# Altium schematic sheet PowerSupply.SchDoc
size A4; SheetNumber: 1; SheetTotal: 2
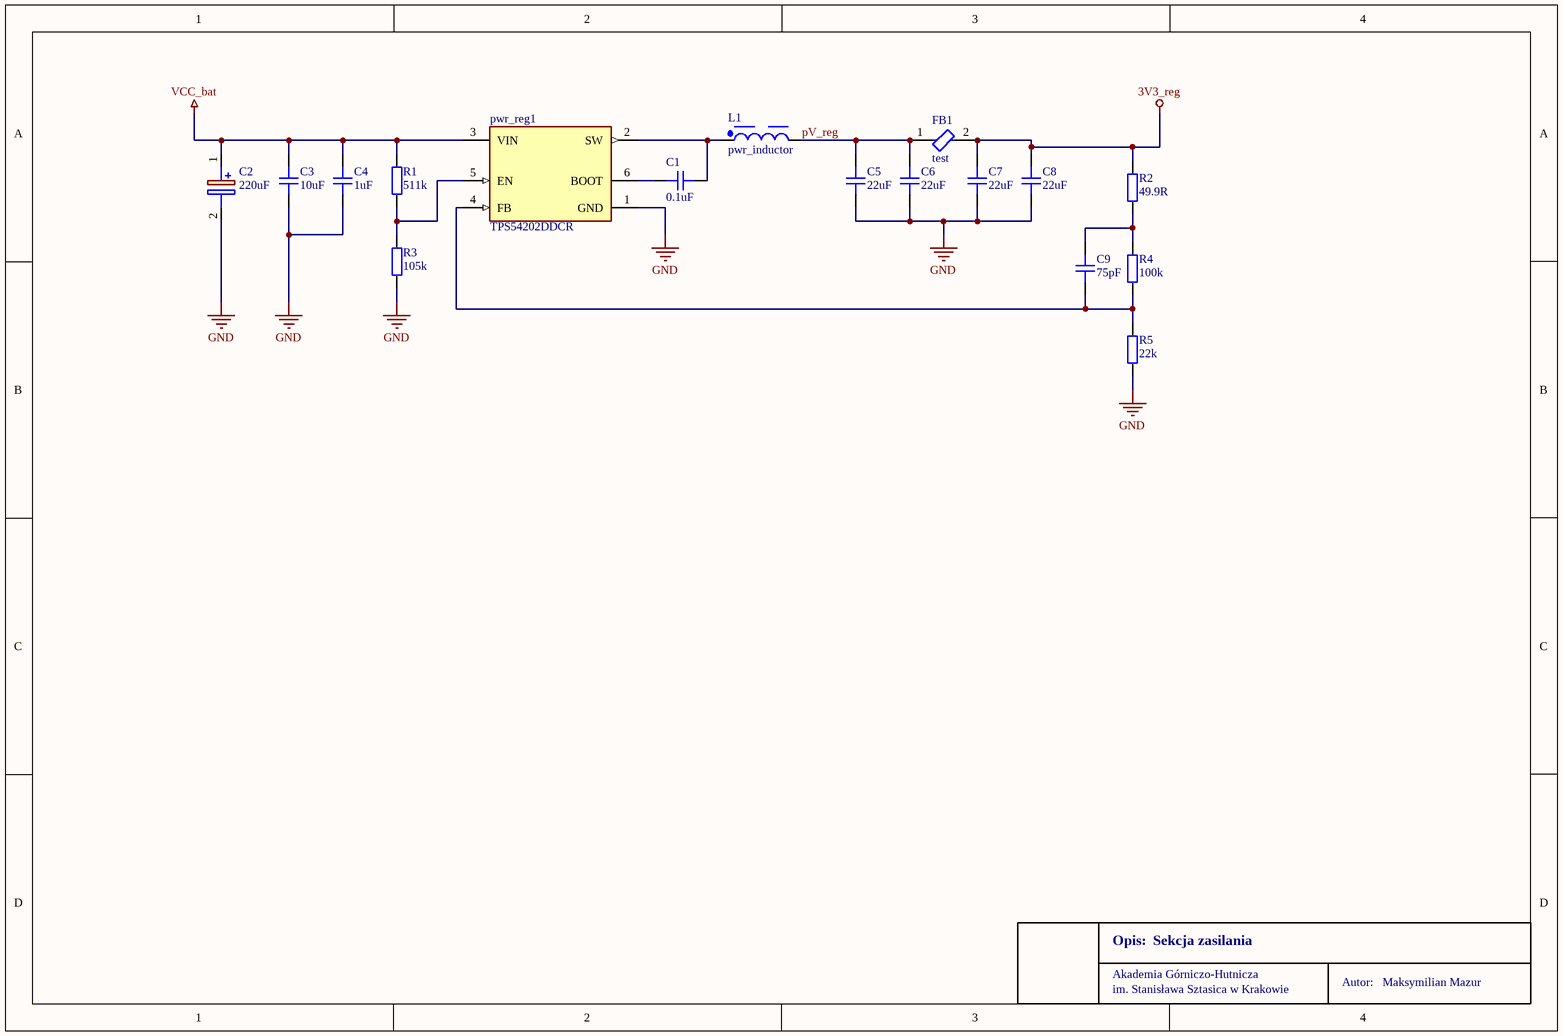
[diagram p0: PowerSupply.SchDoc]

## Parts
C1  0.1uF  [CAP_0603]
C2  220uF  [CAPAE660X810N]
C3  10uF  [CAP_1206]
C4  1uF  [CAP_0603]
C5  22uF  [CAP_0603]
C6  22uF  [CAP_0603]
C7  22uF  [CAP_0603]
C8  22uF  [CAP_0603]
C9  75pF  [CAP_0603]
FB1  test  [FP-BLM18-0_15-t0_8-IPC_A]
L1  pwr_inductor  [WE-PD_7345]
pwr_reg1  TPS54202DDCR  [FP-DDC0006A-IPC_B]
R1  511k  [RES_0603]
R2  49.9R  [RES_0603]
R3  105k  [RES_0603]
R4  100k  [RES_0603]
R5  22k  [RES_0603]

## Nets
3V3_reg: C7.2 C8.2 FB1.2 R2.2
GND: C2.2(-) C3.1 C4.1 C5.1 C6.1 C7.1 C8.1 pwr_reg1.1(GND) R3.1 R5.2
VCC_bat: C2.1(+) C3.2 C4.2 pwr_reg1.3(VIN) R1.2
pV_reg: C5.2 C6.2 FB1.1 L1.2
NetC1_1: C1.1 L1.1 pwr_reg1.2(SW)
NetC1_2: C1.2 pwr_reg1.6(BOOT)
NetC9_1: C9.1 pwr_reg1.4(FB) R4.1 R5.1
NetC9_2: C9.2 R2.1 R4.2
Netpwr_reg1_5: pwr_reg1.5(EN) R1.1 R3.2

## Notes on the sheet
- Akademia Górniczo-Hutnicza
- Opis:
- Sekcja zasilania
- Autor:
- Maksymilian Mazur
- im. Stanisława Sztasica w Krakowie

## Library data of the parts
C1 C5-C8 = CAP_0603: Capacitor SMD 0603 / X7R / LOW ESR; Manufacturer: *; Manufacturer Part Number: *; Distributor Link: *; LCSC: *; Rating: *; Dielectric: *
C2 = SC1C227M6L07KVR: Cap 16V 220uF / Input current decap; Manufacturer_Name: SAMWHA; Datasheet Link: https://octopart.com/datasheet/sc1c227m6l07kvr-samwha-30812620; Height: 8.1mm; Manufacturer_Part_Number: SC1C227M6L07KVR
C3 = CAP_1206: Capacitor SMD 1206 / 25V; Manufacturer: *; Manufacturer Part Number: *; Distributor Link: *; LCSC: *; Rating: *; Dielectric: *
C4 = CAP_0603: Capacitor SMD 0603 / 25V; Manufacturer: *; Manufacturer Part Number: *; Distributor Link: *; LCSC: *; Rating: *; Dielectric: *
C9 = CAP_0603: Capacitor SMD 0603; Manufacturer: *; Manufacturer Part Number: *; Distributor Link: *; LCSC: *; Rating: *; Dielectric: *
FB1 = CMP-0686-00557-7: Chip Ferrite Bead, 0603 / For testing purpose; Impedance: 120R; Frequency: 100MHz; Number of Circuits: 1; Max Current Rating: 2A; Shielding: Unshielded; Material: Steel; DC Resistance (DCR): 50mR; Tolerance: 25%; Case Code (Imperial): 0603; RoHS Compliant: Yes; Number of Pins: 2; Min Operating Temperature: -55°C; Case Code (Metric): 1608; Length: 1.6mm; Test Frequency: 100MHz; Max Operating Temperature: 125°C; Packaging: Tape and Reel; Termination: SMD/SMT; Lead Free: Lead Free; Max DC Current: 2A; Case/Package: 0603; Height: 0.8mm; Current Rating: 2A; Radiation Hardening: No; Core Material: Ferrite; DC Current: 2A; REACH SVHC: No SVHC; Package Quantity: 1; Depth: 0.8mm; Number of Lines: 1; Width: 0.8mm
L1 = CMP-0227-00155-2: 15uF, 2.7A  HPI0630-150; NexarPartId: 31136509; Self Resonant Frequency: 9.5MHz; Inductance: 15µH; Tolerance: 20%; DC Resistance (DCR): 110mΩ; Shielding: Shielded; Ambient Temperature Range Low: -40°C; Depth: 7.3mm; Max Operating Temperature: 125°C; Length: 7.3mm; Max DC Current: 2.7A; Height: 4.5mm; Current Rating: 2.7A; Width: 7.3mm; Number of Pins: 2; Min Operating Temperature: -40°C; Ambient Temperature Range High: 85°C; RoHS: Compliant; Packaging: Tape & Reel
pwr_reg1 = CMP-04918-000439-1: IC REG BUCK ADJ 2A TSOT23-6; Switching Frequency: 500kHz; Quiescent Current: 40uA; Max Output Voltage: 28V; Output Configuration: Positive; Min Output Voltage: 596mV; Min Input Voltage: 4.5V; Synchronous Rectifier: Yes; Output Type: Adjustable; Number of Outputs: 1; Packaging: Tape and Reel; Case/Package: SOT-23-6; RoHS Compliant: Yes; Max Input Voltage: 28V; Max Operating Temperature: 125°C; Min Operating Temperature: -40°C; Output Current: 2A; Lead Free: Lead Free; Mount: Surface Mount; ComponentLink1Description: datasheet; ComponentLink1URL: https://www.ti.com/lit/ds/symlink/tps54202.pdf
R1 R3 = RES_0603: Resistor SMD 0603 /; Manufacturer: *; Manufacturer Part Number: *; Distributor Link: *; LCSC: *
R2 = RES_0603: Resistor SMD 0603; Manufacturer: *; Manufacturer Part Number: *; Distributor Link: *; LCSC: *
R4 R5 = RES_0603: Resistor SMD 0603 / Tolerance 1%; Manufacturer: *; Manufacturer Part Number: *; Distributor Link: *; LCSC: *